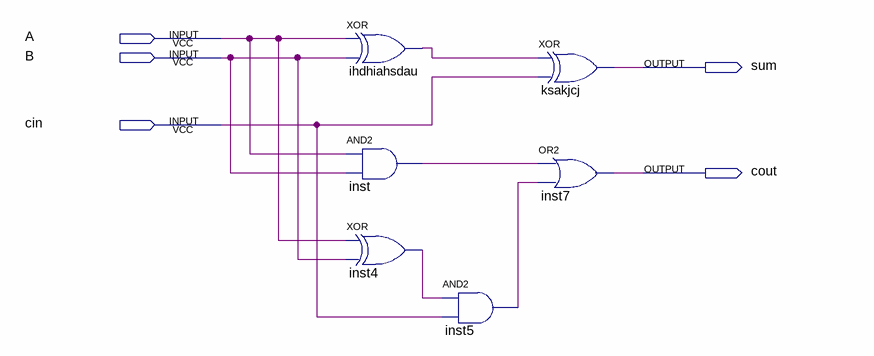
[diagram p0: schematic sheet]
// Quartus schematic Somador.bdf as structural Verilog: 6 symbols, 5 pins
module Somador (
  input  A,
  input  B,
  input  cin,
  output sum,
  output cout
);

  wire ihdhiahsdau_out, inst4_out, inst5_out, inst_out;

  xor ihdhiahsdau (ihdhiahsdau_out, A, B);
  and inst (inst_out, A, B);
  xor inst4 (inst4_out, A, B);
  and inst5 (inst5_out, inst4_out, cin);
  xor ksakjcj (sum, ihdhiahsdau_out, cin);
  or inst7 (cout, inst_out, inst5_out);
endmodule
